# EasyEDA Pro project ALU.eprj

# Schematic Schematic2
Board Name: Board2; Create Date: 2025-08-15; Page Name: P1; Project Name: ALU; Schematic Name: Schematic2; Update Date: 2025-08-15; Company: EasyEDA.com; Page Size: A4; Version: V1.0
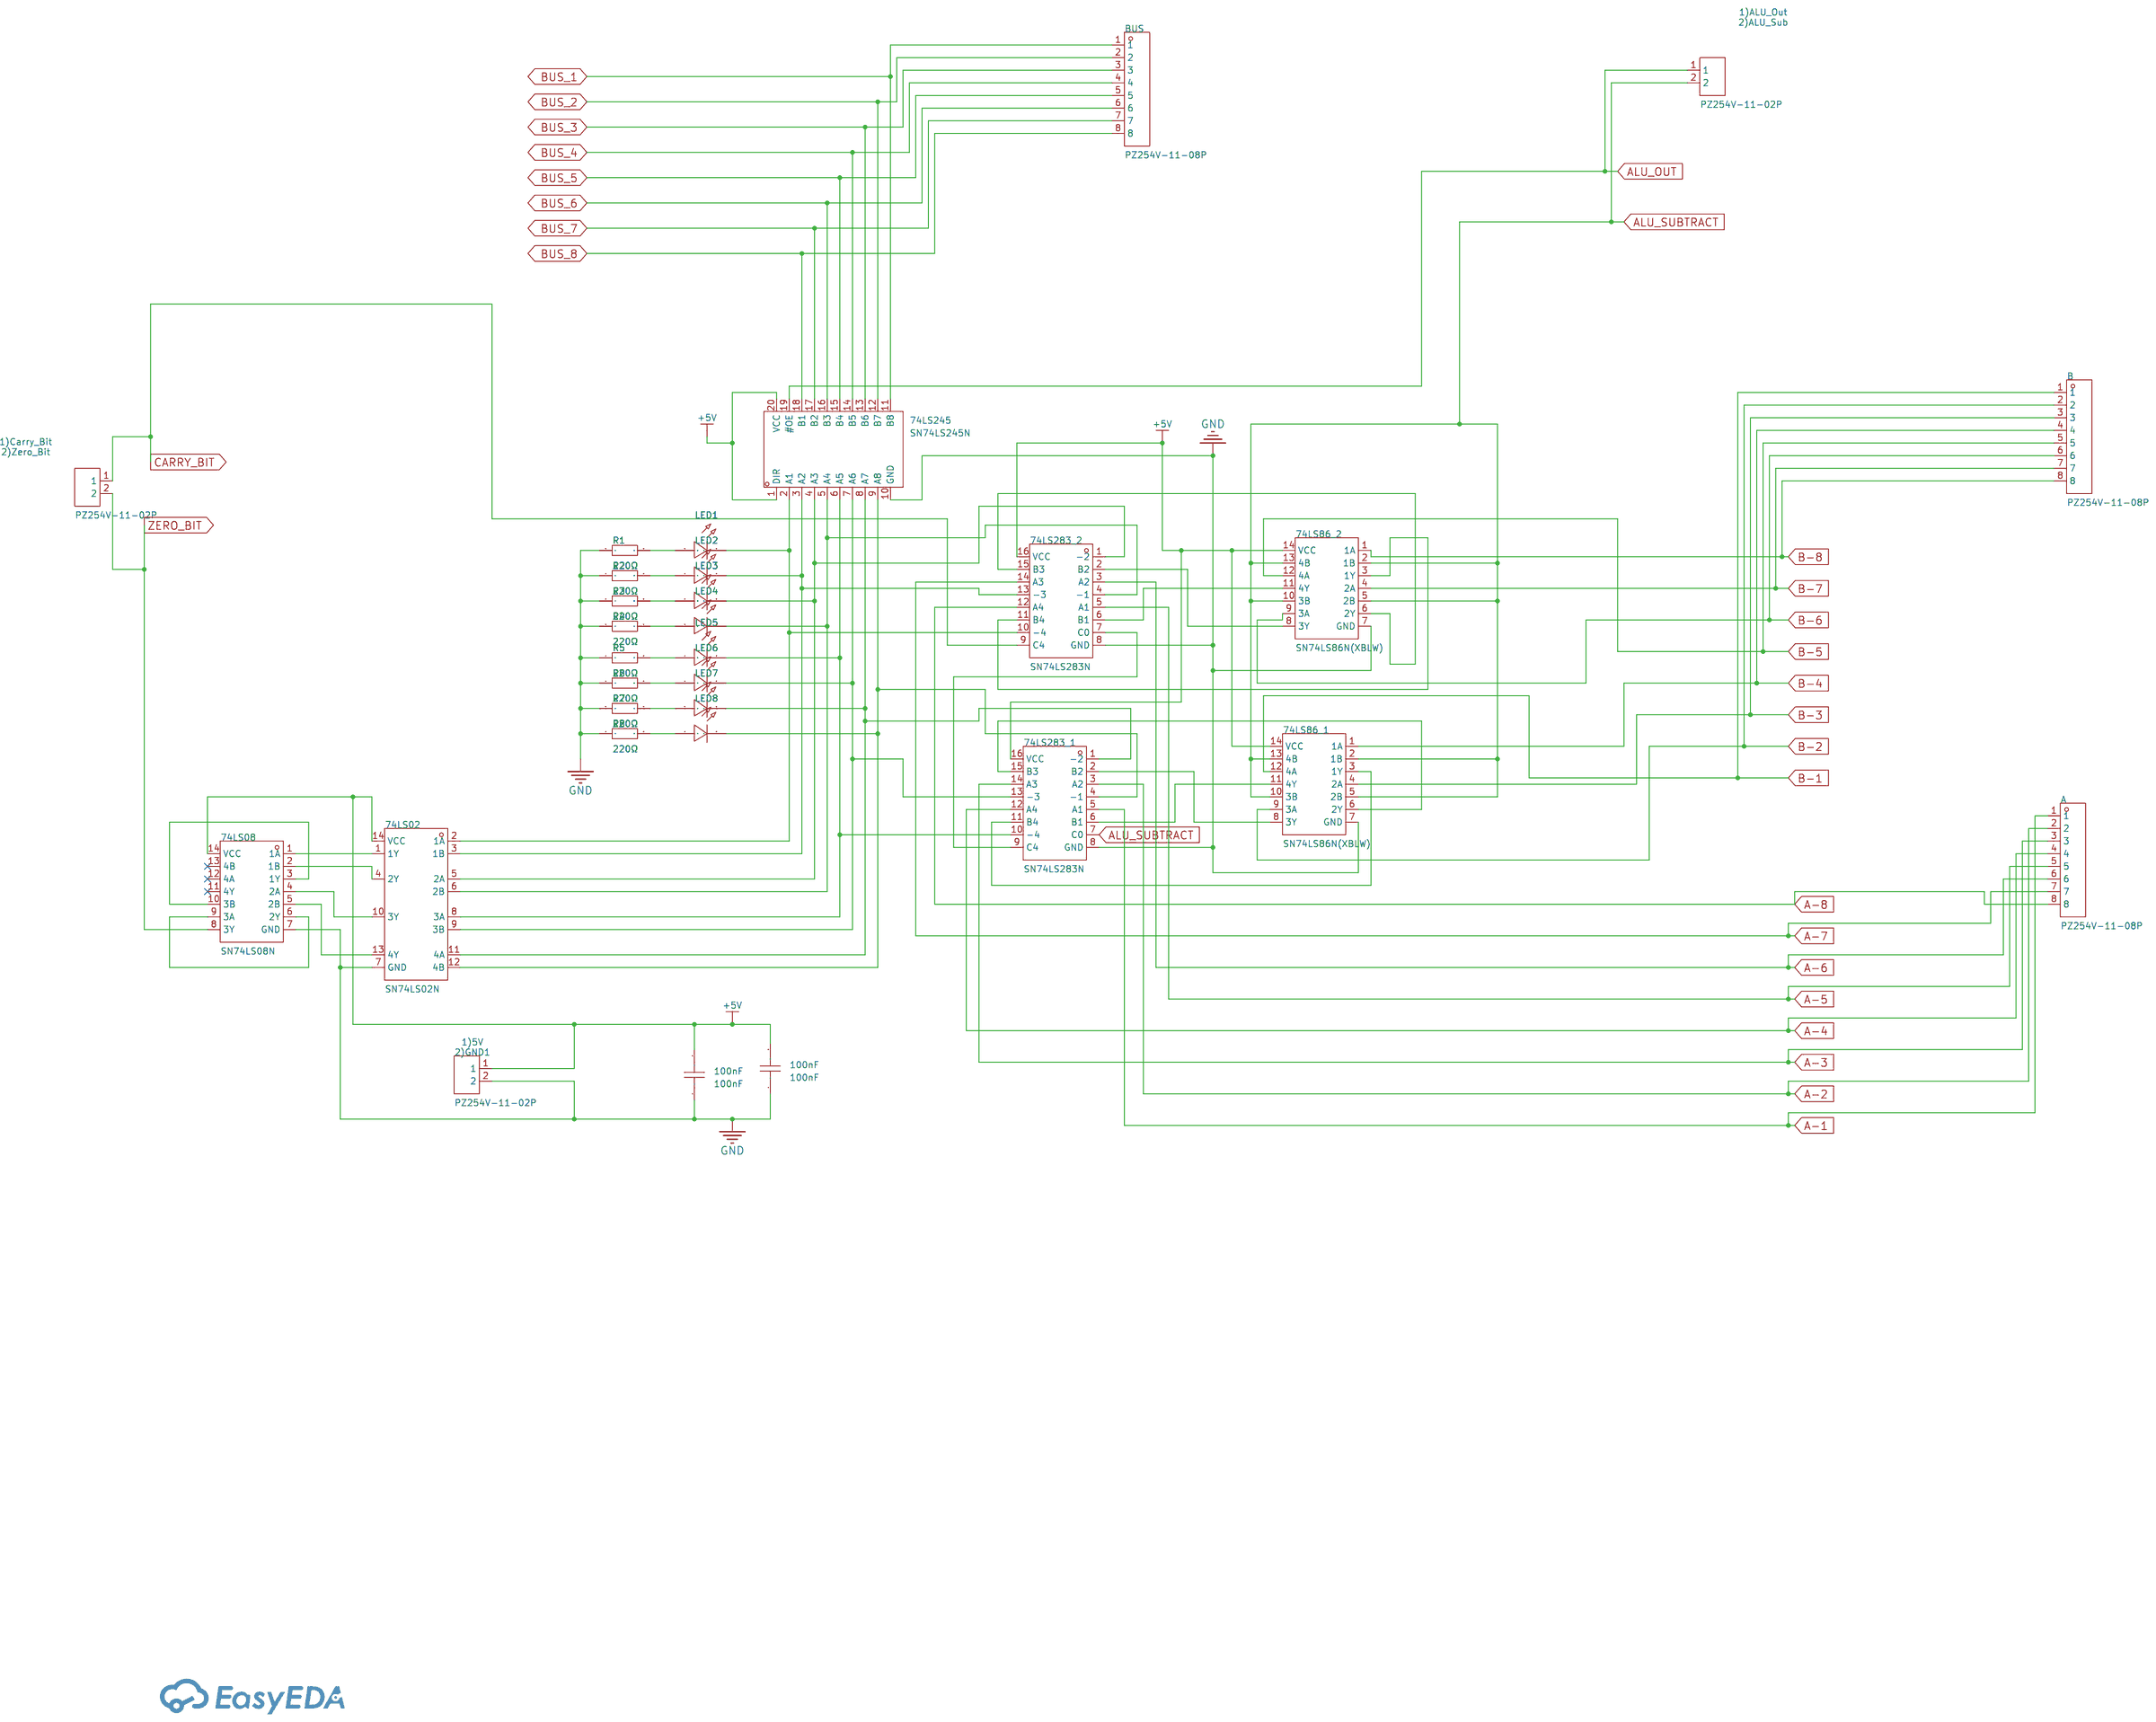
[diagram p0: schematic sheet]

## Parts
1)5V
2)GND1  PZ254V-11-02P  [HDR-TH_2P-P2.54-V-M]
1)ALU_Out
2)ALU_Sub  PZ254V-11-02P  [HDR-TH_2P-P2.54-V-M]
1)Carry_Bit
2)Zero_Bit  PZ254V-11-02P  [HDR-TH_2P-P2.54-V-M]
74LS02  SN74LS02N  [PDIP-14_L19.3-W6.4-P2.54-LS7.6-BL]
74LS08  SN74LS08N  [PDIP-14_L19.3-W6.4-P2.54-LS7.9-BL-1]
74LS86_1  SN74LS86N(XBLW)  [DIP-14_L19.0-W6.4-P2.54-LS7.6-BL]
74LS86_2  SN74LS86N(XBLW)  [DIP-14_L19.0-W6.4-P2.54-LS7.6-BL]
74LS245  SN74LS245N  [DIP-20_L25.5-W10.0-P2.54-LS7.6-BL]
74LS283_1  SN74LS283N  [PDIP-16_L19.3-W6.4-P2.54-LS7.94-BL]
74LS283_2  SN74LS283N  [PDIP-16_L19.3-W6.4-P2.54-LS7.94-BL]
100nF  100nF  [CAP-TH_L8.5-W5.0-P5.00-D1.2]
100nF#2  100nF  [CAP-TH_L8.5-W5.0-P5.00-D1.2]
A  PZ254V-11-08P  [HDR-TH_8P-P2.54-V-M]
B  PZ254V-11-08P  [HDR-TH_8P-P2.54-V-M]
BUS  PZ254V-11-08P  [HDR-TH_8P-P2.54-V-M]
LED1  -  [LED-TH_BD5.8-P2.54-FD]
LED2  -  [LED-TH_BD5.8-P2.54-FD]
LED3  -  [LED-TH_BD5.8-P2.54-FD]
LED4  -  [LED-TH_BD5.8-P2.54-FD]
LED5  -  [LED-TH_BD5.8-P2.54-FD]
LED6  -  [LED-TH_BD5.8-P2.54-FD]
LED7  -  [LED-TH_BD5.8-P2.54-FD]
LED8  -  [LED-TH_BD5.8-P2.54-FD]
R1  220Ω  [R_AXIAL-0.4]
R2  220Ω  [R_AXIAL-0.4]
R3  220Ω  [R_AXIAL-0.4]
R4  220Ω  [R_AXIAL-0.4]
R5  220Ω  [R_AXIAL-0.4]
R6  220Ω  [R_AXIAL-0.4]
R7  220Ω  [R_AXIAL-0.4]
R8  220Ω  [R_AXIAL-0.4]

## Library data of the parts
1)5V
2)GND1 1)ALU_Out
2)ALU_Sub 1)Carry_Bit
2)Zero_Bit = PZ254V-11-02P: Pin Structure:1x2P Pitch:2.54mm Row Spacing:- Circluar Pins/Square Pins:Policy Mounting Type:Straight Number of Rows:Single Row Number of Pins:2P Current Rating:- Voltage Rating (Max):- Length of Mating Pin:6mm Insulation Height:2.5mm Length of End Connec; LCSC Part Name: 1x2P 间距:2.54mm 方针 直插; Supplier Part: C492401; Manufacturer: XFCN(兴飞); Supplier Footprint: 插件,P=2.54mm; JLCPCB Part Class: Extended Part; Datasheet: https://atta.szlcsc.com/upload/public/pdf/source/20200309/C492401_A812433581A9B211A7FFA413ADDFF0E5.pdf; Supplier: LCSC; Pin Structure: 1x2P; Pitch: 2.54mm; Circluar Pins/Square Pins: Policy; Mounting Type: Straight; Number of Rows: Single Row; Number of Pins: 2P; Length of Mating Pin: 6mm; Insulation Height: 2.5mm; Length of End Connection Pin: 3mm; Contact Material: Brass; Operating Temperature: -40℃~+105℃; Color: Black
74LS02 = SN74LS02N: Logic Gate Type:NORGate Number of Channels:4 Supply Voltage:4.75V~5.25V Supply Voltage:4.75V~5.25V Sink Current:16mA Source Current:400uA High Level Range (VIH):2V High Level Range (VIH):2V Low Level Range (VIL):800mV Low Level Range (VIL):800mV Series:74; Supplier Part: C273654; Manufacturer: TI(德州仪器); Supplier Footprint: PDIP-14; JLCPCB Part Class: Extended Part; Datasheet: https://www.ti.com/cn/lit/gpn/sn74ls02; Supplier: LCSC; Logic Gate Type: NORGate; Number of Channels: 4; Supply Voltage: 4.75V~5.25V; Sink Current: 16mA; Source Current: 400uA; High Level Range (VIH): 2V; Low Level Range (VIL): 800mV; Series: 74LSSeries; Propagation Delay Time: 15ns@5V,15pF; Operating Temperature: 0℃~+70℃
74LS08 = SN74LS08N: Logic Type:AND Gate Number of Channels:4 Voltage - Supply:4.75V~5.25V Voltage - Supply:4.75V~5.25V Current - Output Low(IOL):8mA Current - Output High(IOH):400uA Input Logic Level - High:2V Input Logic Level - High:2V Input Logic Level - Low:800mV Input L; Supplier Part: C2869595; Manufacturer: TI(德州仪器); Supplier Footprint: PDIP-14; JLCPCB Part Class: Extended Part; Datasheet: https://www.ti.com/cn/lit/gpn/sn54s08; Supplier: LCSC; Logic Type: AND Gate; Number of Channels: 4; Voltage - Supply: 4.75V~5.25V; Current - Output Low(IOL): 8mA; Current - Output High(IOH): 400uA; Input Logic Level - High: 2V; Input Logic Level - Low: 800mV; Series: 74LSSeries; Operating Temperature: 0℃~+70℃
74LS86_1 74LS86_2 = SN74LS86N(XBLW): Logic Type:XOR Gate Number of Channels:4 Voltage - Supply:2V~6V Voltage - Supply:2V~6V Quiescent Current:2uA Current - Output Low(IOL):5.2mA Current - Output High(IOH):5.2mA Input Logic Level - High:1.2V~3.2V Input Logic Level - High:1.2V~3.2V Input Logic; Supplier Part: C42415784; Manufacturer: XBLW(芯伯乐); Supplier Footprint: DIP-14; Datasheet: https://atta.szlcsc.com/upload/public/pdf/source/20241217/4BD867E8FF5FB27D45A6321784BC3EB1.pdf; Supplier: LCSC; Logic Type: XOR Gate; Number of Channels: 4; Voltage - Supply: 2V~6V; Quiescent Current: 2uA; Current - Output Low(IOL): 5.2mA; Current - Output High(IOH): 5.2mA; Input Logic Level - High: 1.2V~3.2V; Input Logic Level - Low: 800mV~2.8V; Output Logic Level - High: 2V~5.81V
74LS245 = SN74LS245N: output type:Tri-State Voltage - Supply:4.75V~5.25V Voltage - Supply:4.75V~5.25V Number of Elements:1 Number of Bits per Element:8 Current - Output Low(IOL):24mA Current - Output High(IOH):15mA Logic Family:74LS Operating Temperature:0℃~+70℃ Operating Temp; Supplier Part: C352966; Manufacturer: TI(德州仪器); Supplier Footprint: DIP-20; JLCPCB Part Class: Extended Part; Datasheet: https://www.ti.com/cn/lit/gpn/sn74ls245; Supplier: LCSC; output type: Tri-State; Voltage - Supply: 4.75V~5.25V; Number of Elements: 1; Number of Bits per Element: 8; Current - Output Low(IOL): 24mA; Current - Output High(IOH): 15mA; Logic Family: 74LS; Operating Temperature: 0℃~+70℃
74LS283_1 74LS283_2 = SN74LS283N: LCSC Part Name: 二进制全加器; Supplier Part: C1523494; Manufacturer: TI(德州仪器); Supplier Footprint: PDIP-16; JLCPCB Part Class: Extended Part; Datasheet: https://www.ti.com/cn/lit/gpn/sn74ls283; Supplier: LCSC
100nF 100nF#2 = CT4-0805B104K500F3: Capacitance:100nF Tolerance:±10% Tolerance:±10% Voltage Rated: Temperature Coefficient:; LCSC Part Name: 100nF ±10% 50V C3型（直脚）; Supplier Part: C84772; Manufacturer: FH(风华); Supplier Footprint: 插件,P=5.08mm; JLCPCB Part Class: Extended Part; Datasheet: https://atta.szlcsc.com/upload/public/pdf/source/20190402/C385200_059806A6312B28FF1421A2413EB641E1.pdf; Supplier: LCSC; Tolerance: ±10%
A B BUS = PZ254V-11-08P: Pin Structure:1x8P Pitch:2.54mm Row Spacing:- Circluar Pins/Square Pins:Square Pins Mounting Type:Straight Number of Rows:Plugin Number of Pins:8P Current Rating (Max):- Voltage Rating (Max):- Length of Mating Pin:6mm Insulation Height:2.5mm Length of End; LCSC Part Name: 间距:2.54mm 1x8P 直插 方针; Supplier Part: C492407; Manufacturer: XFCN(兴飞); Supplier Footprint: 插件,P=2.54mm; JLCPCB Part Class: Extended Part; Datasheet: https://atta.szlcsc.com/upload/public/pdf/source/20200309/C492407_83A6FB26A2233368EDB9516968EC6149.pdf; Supplier: LCSC; Pin Structure: 1x8P; Pitch: 2.54mm; Circluar Pins/Square Pins: Square Pins; Mounting Type: Straight; Number of Rows: Plugin; Number of Pins: 8P; Length of Mating Pin: 6mm; Insulation Height: 2.5mm; Length of End Connection Pin: 3mm; Operating Temperature Range: -40℃~+105℃; Color: Black
LED1-LED8 = LED_TH-R_5mm: Supplier Footprint: Through
R1-R8 = Res_AXIAL-1/4W: Supplier Footprint: Through

## Nets
+5V: 1)5V
2)GND1.1 74LS02.14(VCC) 74LS08.14(VCC) 74LS86_1.14(VCC) 74LS86_2.14(VCC) 74LS245.1(DIR) 74LS245.20(VCC) 74LS283_1.16(VCC) 74LS283_2.16(VCC) 100nF.2 100nF#2.2
GND: 1)5V
2)GND1.2 74LS02.7(GND) 74LS08.7(GND) 74LS86_1.7(GND) 74LS86_2.7(GND) 74LS245.10(GND) 74LS283_1.8(GND) 74LS283_2.8(GND) 100nF.1 100nF#2.1 R1.1 R2.1 R3.1 R4.1 R5.1 R6.1 R7.1 R8.1
A-1: 74LS283_1.5(A1) A.1
A-2: 74LS283_1.3(A2) A.2
A-3: 74LS283_1.14(A3) A.3
A-4: 74LS283_1.12(A4) A.4
A-5: 74LS283_2.5(A1) A.5
A-6: 74LS283_2.3(A2) A.6
A-7: 74LS283_2.14(A3) A.7
A-8: 74LS283_2.12(A4) A.8
ALU_OUT: 1)ALU_Out
2)ALU_Sub.1 74LS245.19(#OE)
ALU_SUBTRACT: 1)ALU_Out
2)ALU_Sub.2 74LS86_1.2(1B) 74LS86_1.5(2B) 74LS86_1.10(3B) 74LS86_1.13(4B) 74LS86_2.2(1B) 74LS86_2.5(2B) 74LS86_2.10(3B) 74LS86_2.13(4B) 74LS283_1.7(C0)
B-1: 74LS86_1.12(4A) B.1
B-2: 74LS86_1.9(3A) B.2
B-3: 74LS86_1.4(2A) B.3
B-4: 74LS86_1.1(1A) B.4
B-5: 74LS86_2.12(4A) B.5
B-6: 74LS86_2.9(3A) B.6
B-7: 74LS86_2.4(2A) B.7
B-8: 74LS86_2.1(1A) B.8
BUS_1: 74LS245.11(B8) BUS.1
BUS_2: 74LS245.12(B7) BUS.2
BUS_3: 74LS245.13(B6) BUS.3
BUS_4: 74LS245.14(B5) BUS.4
BUS_5: 74LS245.15(B4) BUS.5
BUS_6: 74LS245.16(B3) BUS.6
BUS_7: 74LS245.17(B2) BUS.7
BUS_8: 74LS245.18(B1) BUS.8
CARRY_BIT: 1)Carry_Bit
2)Zero_Bit.1 74LS283_2.9(C4)
ZERO_BIT: 1)Carry_Bit
2)Zero_Bit.2 74LS08.8(3Y)
$1N3474: LED1.1(C) R1.2
$1N3475: 74LS02.2(1A) 74LS245.2(A1) 74LS283_2.10(-4) LED1.2(A)
$1N3476: LED2.1(C) R2.2
$1N3477: LED3.1(C) R3.2
$1N3478: 74LS02.5(2A) 74LS245.4(A3) 74LS283_2.1(-2) LED3.2(A)
$1N3479: LED4.1(C) R4.2
$1N3480: LED5.1(C) R5.2
$1N3481: LED6.1(C) R6.2
$1N3482: LED7.1(C) R7.2
$1N3483: 74LS02.11(4A) 74LS245.8(A7) 74LS283_1.1(-2) LED7.2(A)
$1N3484: LED8.1(C) R8.2
$1N3486: 74LS02.1(1Y) 74LS08.1(1A)
$1N3487: 74LS08.3(1Y) 74LS08.10(3B)
$1N3488: 74LS02.10(3Y) 74LS08.4(2A)
$1N3489: 74LS02.4(2Y) 74LS08.2(1B)
$1N3491: 74LS02.8(3A) 74LS245.6(A5) 74LS283_1.10(-4) LED5.2(A)
$1N3492: 74LS02.6(2B) 74LS245.5(A4) 74LS283_2.4(-1) LED4.2(A)
$1N3493: 74LS02.3(1B) 74LS245.3(A2) 74LS283_2.13(-3) LED2.2(A)
$1N3494: 74LS283_1.9(C4) 74LS283_2.7(C0)
$1N3495: 74LS02.12(4B) 74LS245.9(A8) 74LS283_1.4(-1) LED8.2(A)
$1N3496: 74LS02.9(3B) 74LS245.7(A6) 74LS283_1.13(-3) LED6.2(A)
$1N3497: 74LS86_2.3(1Y) 74LS283_2.11(B4)
$1N3498: 74LS86_2.8(3Y) 74LS283_2.2(B2)
$1N3499: 74LS86_2.11(4Y) 74LS283_2.6(B1)
$1N3502: 74LS86_1.3(1Y) 74LS283_1.11(B4)
$1N3503: 74LS86_1.6(2Y) 74LS283_1.15(B3)
$1N3504: 74LS86_1.11(4Y) 74LS283_1.6(B1)
$1N3511: 74LS86_1.8(3Y) 74LS283_1.2(B2)
$1N3518: 74LS86_2.6(2Y) 74LS283_2.15(B3)
$1N3523: 74LS08.6(2Y) 74LS08.9(3A)
$1N3524: 74LS02.13(4Y) 74LS08.5(2B)

Not connected (* = marked no-connect by the designer): 74LS08 11(4Y)* 12(4A)* 13(4B)*

# Board PCB2
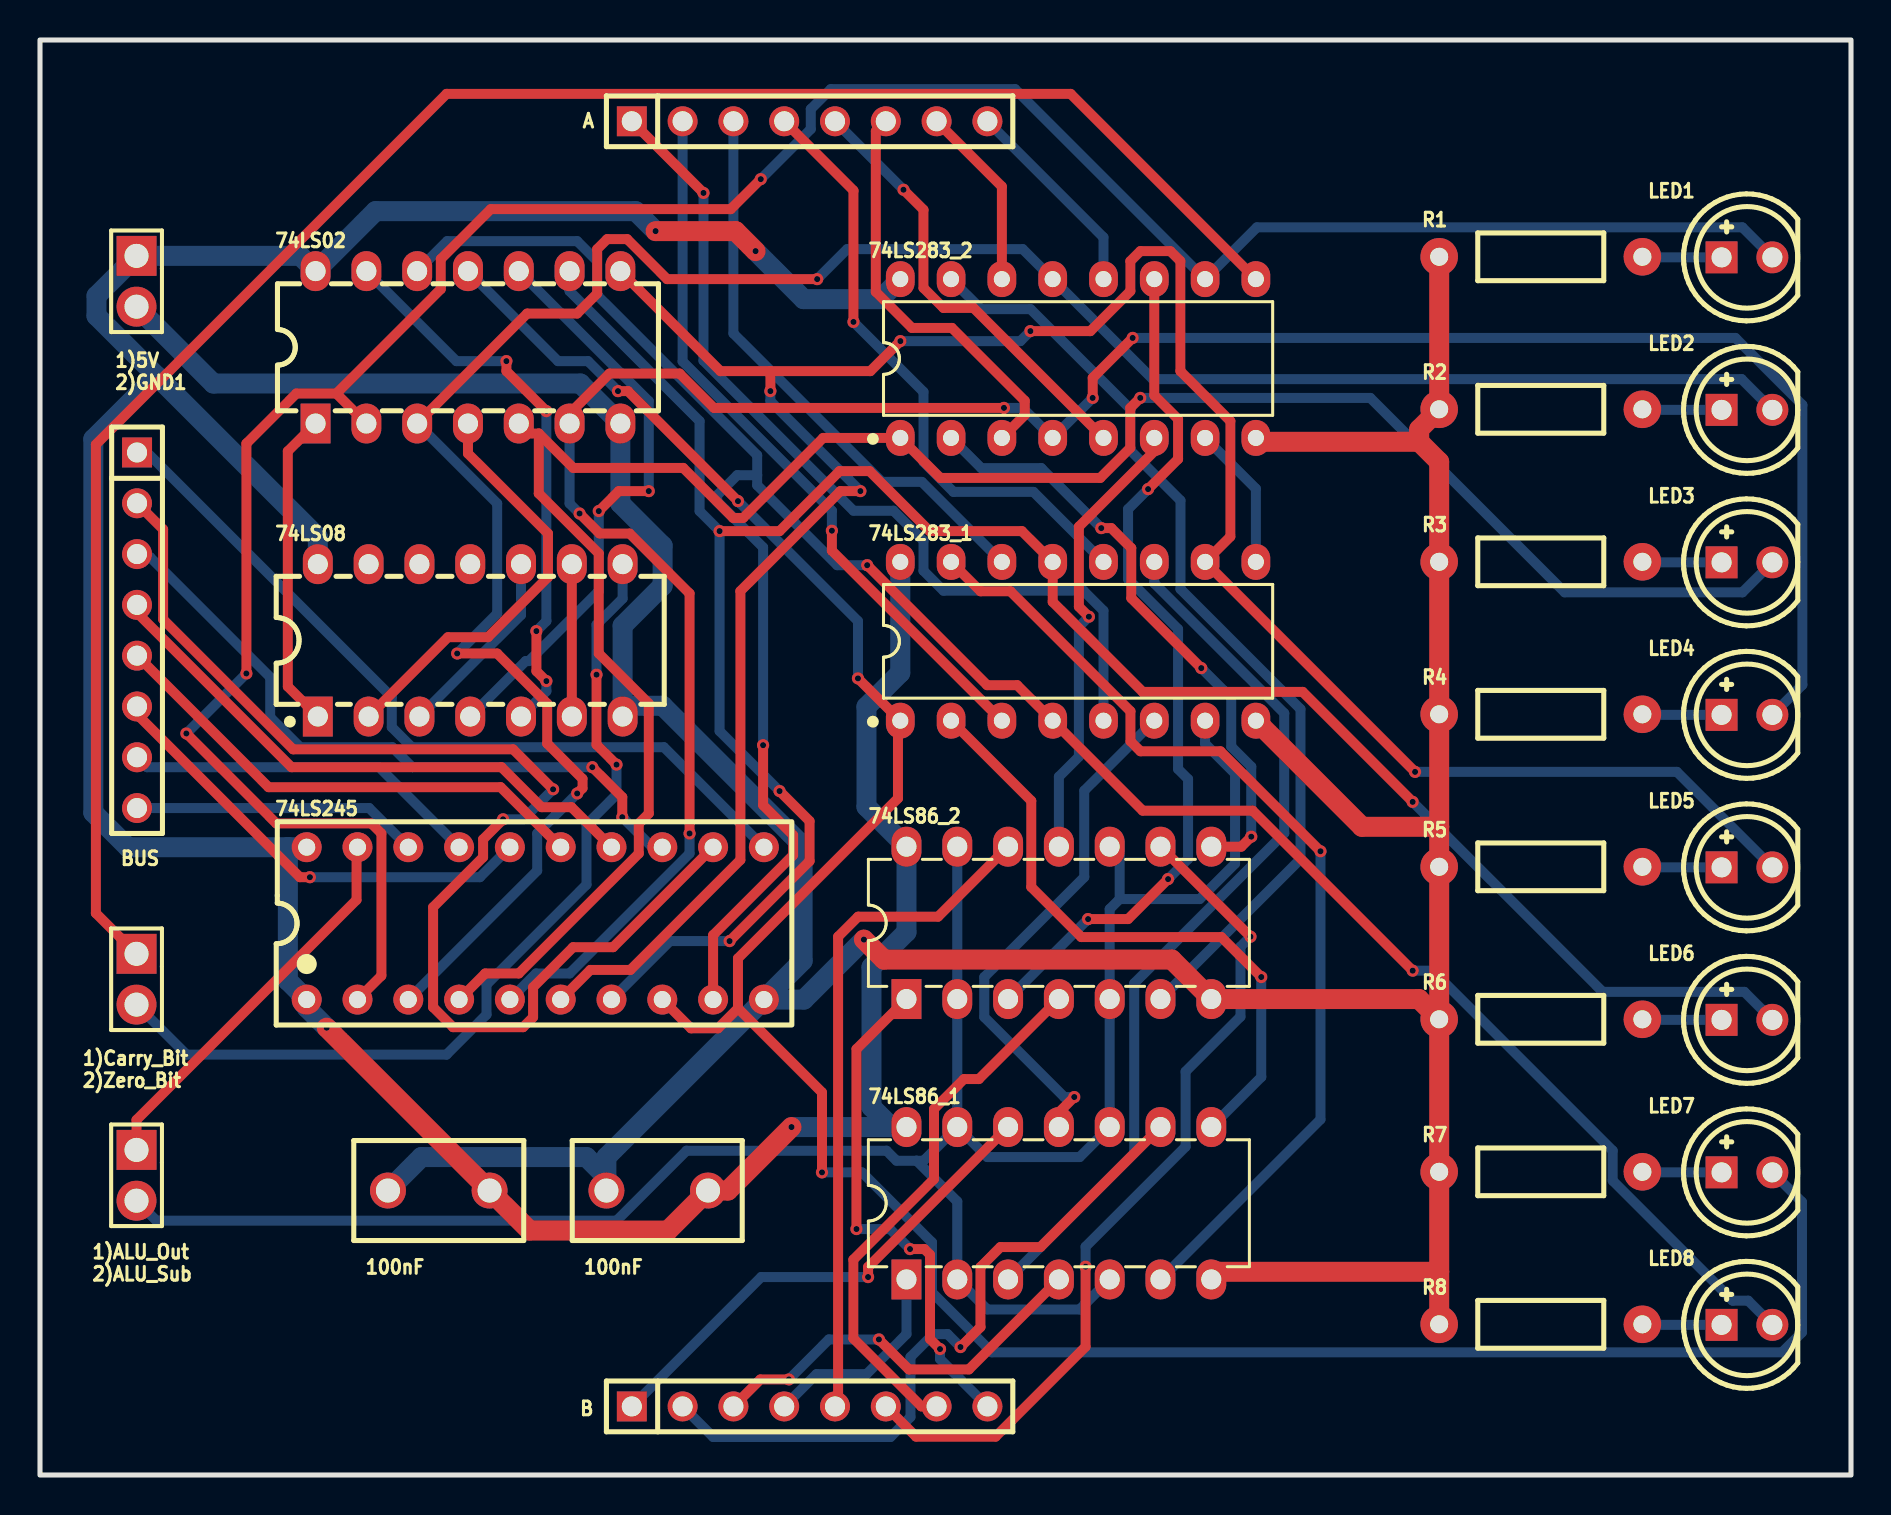
[diagram p1: board, top side]
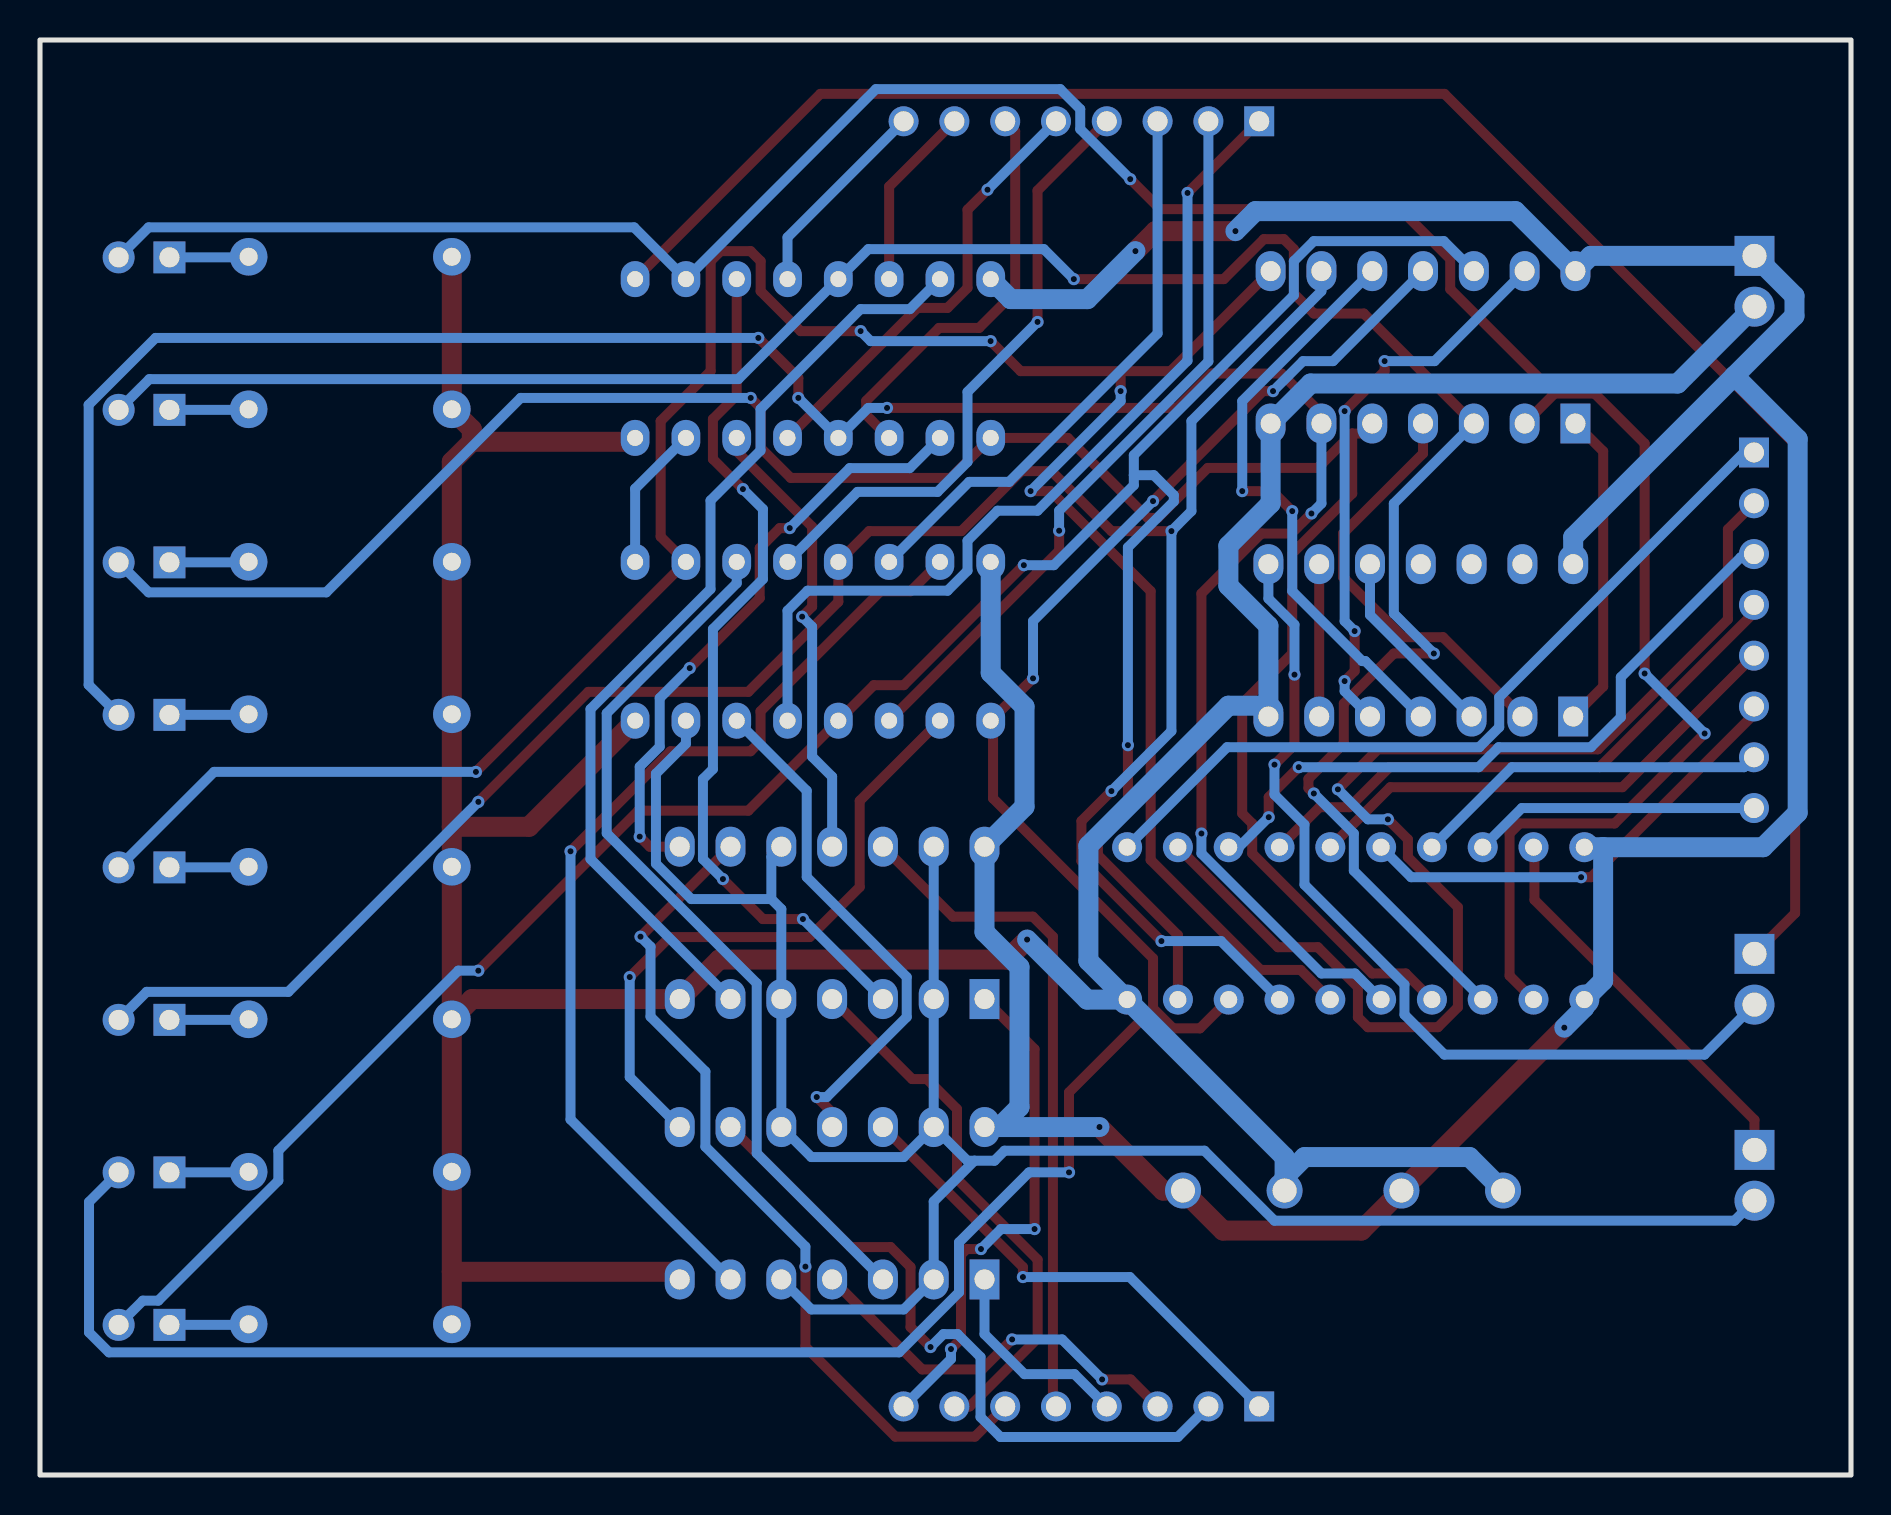
[diagram p2: board, bottom side, seen from below]

Outline 90.55 x 71.75 mm; copper layers: Top Layer, Bottom Layer. Coordinates in mm from the lower left corner of the outline.
Outline path: rectangle 0,71.75 90.55,0
Stack: Top Layer 0.035mm / Dielectric1 1.51mm FR4 er 4.5 / Bottom Layer 0.035mm

## Design rules (mm)
template: Custom Config
spacing copperThickness1oz (default): track to track 0.102, other pairs 0.152 to 0.3
spacing copperThickness2oz: track to track 0.203, other pairs 0.152 to 0.3
track width copperThickness1oz (default): min 0.127, default 0.5, max 2.54
track width copperThickness2oz: min 0.203, default 1, max 2.54
differential pair differentialPair (default): width min 0.127, default 0.254, max 2.54; gap min 0.152, default 0.152
via viaSize (default): diameter min 0.5, default 0.61, max 10; hole min 0.3, default 0.305, max 6.3
net +5V uses copperThickness2oz
net GND uses copperThickness2oz

## Placement (name value [footprint] x y rotation side)
1)5V
2)GND1  PZ254V-11-02P  [HDR-TH_2P-P2.54-V-M]  4.83 59.69 270 top
1)ALU_Out
2)ALU_Sub  PZ254V-11-02P  [HDR-TH_2P-P2.54-V-M]  4.83 14.99 270 top
1)Carry_Bit
2)Zero_Bit  PZ254V-11-02P  [HDR-TH_2P-P2.54-V-M]  4.83 24.79 270 top
74LS02  SN74LS02N  [PDIP-14_L19.3-W6.4-P2.54-LS7.6-BL]  21.4 56.39 0 top
74LS08  SN74LS08N  [PDIP-14_L19.3-W6.4-P2.54-LS7.9-BL-1]  21.51 41.74 0 top
74LS86_1  SN74LS86N(XBLW)  [DIP-14_L19.0-W6.4-P2.54-LS7.6-BL]  50.94 13.59 0 top
74LS86_2  SN74LS86N(XBLW)  [DIP-14_L19.0-W6.4-P2.54-LS7.6-BL]  50.94 27.61 0 top
74LS245  SN74LS245N  [DIP-20_L25.5-W10.0-P2.54-LS7.6-BL]  24.77 27.58 0 top
74LS283_1  SN74LS283N  [PDIP-16_L19.3-W6.4-P2.54-LS7.94-BL]  51.9 41.69 0 top
74LS283_2  SN74LS283N  [PDIP-16_L19.3-W6.4-P2.54-LS7.94-BL]  51.9 55.83 0 top
100nF  100nF  [CAP-TH_L8.5-W5.0-P5.00-D1.2]  19.94 14.22 0 top
100nF#2  100nF  [CAP-TH_L8.5-W5.0-P5.00-D1.2]  30.86 14.22 0 top
A  PZ254V-11-08P  [HDR-TH_8P-P2.54-V-M]  38.48 67.69 0 top
B  PZ254V-11-08P  [HDR-TH_8P-P2.54-V-M]  38.48 3.43 0 top
BUS  PZ254V-11-08P  [HDR-TH_8P-P2.54-V-M]  4.85 42.24 270 top
LED1  -  [LED-TH_BD5.8-P2.54-FD]  85.35 60.89 0 top
LED2  -  [LED-TH_BD5.8-P2.54-FD]  85.35 53.26 0 top
LED3  -  [LED-TH_BD5.8-P2.54-FD]  85.35 45.63 0 top
LED4  -  [LED-TH_BD5.8-P2.54-FD]  85.35 38.01 0 top
LED5  -  [LED-TH_BD5.8-P2.54-FD]  85.35 30.38 0 top
LED6  -  [LED-TH_BD5.8-P2.54-FD]  85.35 22.76 0 top
LED7  -  [LED-TH_BD5.8-P2.54-FD]  85.35 15.13 0 top
LED8  -  [LED-TH_BD5.8-P2.54-FD]  85.35 7.51 0 top
R1  220Ω  [R_AXIAL-0.4]  75.04 60.91 0 top
R2  220Ω  [R_AXIAL-0.4]  75.04 53.29 0 top
R3  220Ω  [R_AXIAL-0.4]  75.04 45.66 0 top
R4  220Ω  [R_AXIAL-0.4]  75.04 38.04 0 top
R5  220Ω  [R_AXIAL-0.4]  75.04 30.41 0 top
R6  220Ω  [R_AXIAL-0.4]  75.04 22.79 0 top
R7  220Ω  [R_AXIAL-0.4]  75.04 15.16 0 top
R8  220Ω  [R_AXIAL-0.4]  75.04 7.54 0 top

## Footprints (pads in the part's own frame, mm; a bottom-side part is the same pattern mirrored in y, then rotated)
CAP-TH_L8.5-W5.0-P5.00-D1.2
  round 1.8 hole 1.2: 1(-2.54,0) 2(2.54,0)
DIP-14_L19.0-W6.4-P2.54-LS7.6-BL
  rect 1.5x2 hole 1: 1(-7.62,-3.81)
  oval 1.5x2 hole 1: 2(-5.08,-3.81) 3(-2.54,-3.81) 4(0,-3.81) 5(2.54,-3.81) 6(5.08,-3.81) 7(7.62,-3.81) 8(7.62,3.81) 9(5.08,3.81) 10(2.54,3.81) 11(0,3.81) 12(-2.54,3.81) 13(-5.08,3.81) 14(-7.62,3.81)
DIP-20_L25.5-W10.0-P2.54-LS7.6-BL
  round 1.5 hole 0.85: 1(-11.43,-3.81) 2(-8.89,-3.81) 3(-6.35,-3.81) 4(-3.81,-3.81) 5(-1.27,-3.81) 6(1.27,-3.81) 7(3.81,-3.81) 8(6.35,-3.81) 9(8.89,-3.81) 10(11.43,-3.81) 11(11.43,3.81) 12(8.89,3.81) 13(6.35,3.81) 14(3.81,3.81) 15(1.27,3.81) 16(-1.27,3.81) 17(-3.81,3.81) 18(-6.35,3.81) 19(-8.89,3.81) 20(-11.43,3.81)
HDR-TH_2P-P2.54-V-M
  rect 2x2 hole 1.2: 1(-1.27,0)
  round 2 hole 1.2: 2(1.27,0)
HDR-TH_8P-P2.54-V-M
  rect 1.5x1.5 hole 1: 1(-8.89,0)
  round 1.5 hole 1: 2(-6.35,0) 3(-3.81,0) 4(-1.27,0) 5(1.27,0) 6(3.81,0) 7(6.35,0) 8(8.89,0)
LED-TH_BD5.8-P2.54-FD
  rect 1.6x1.6 hole 1: 1(-1.27,0)
  round 1.6 hole 1: 2(1.27,0)
PDIP-14_L19.3-W6.4-P2.54-LS7.6-BL
  rect 1.5x2 hole 1: 1(-7.62,-3.81)
  oval 1.5x2 hole 1: 2(-5.08,-3.81) 3(-2.54,-3.81) 4(0,-3.81) 5(2.54,-3.81) 6(5.08,-3.81) 7(7.62,-3.81) 8(7.62,3.81) 9(5.08,3.81) 10(2.54,3.81) 11(0,3.81) 12(-2.54,3.81) 13(-5.08,3.81) 14(-7.62,3.81)
PDIP-14_L19.3-W6.4-P2.54-LS7.9-BL-1
  rect 1.5x2 hole 1: 1(-7.62,-3.809)
  oval 1.5x2 hole 1: 2(-5.08,-3.81) 3(-2.54,-3.81) 4(0,-3.81) 5(2.54,-3.81) 6(5.08,-3.81) 7(7.62,-3.81) 8(7.62,3.81) 9(5.08,3.81) 10(2.54,3.81) 11(0,3.81) 12(-2.54,3.81) 13(-5.08,3.81) 14(-7.62,3.81)
PDIP-16_L19.3-W6.4-P2.54-LS7.94-BL
  oval 1.44x1.8 hole 0.8: 1(-8.89,-3.97) 2(-6.35,-3.97) 3(-3.81,-3.97) 4(-1.27,-3.97) 5(1.27,-3.97) 6(3.81,-3.97) 7(6.35,-3.97) 8(8.89,-3.97) 9(8.89,3.97) 10(6.35,3.97) 11(3.81,3.97) 12(1.27,3.97) 13(-1.27,3.97) 14(-3.81,3.97) 15(-6.35,3.97) 16(-8.89,3.97)
R_AXIAL-0.4
  round 1.879 hole 0.899: 1(-5.08,0) 2(5.08,0)

## Nets
As in the schematic.

Pads without a net: 74LS08 11 12 13

## Via types
v1: diameter 0.61, hole 0.305, Top Layer to Bottom Layer, 69 vias

## Routing (per net, layer and track width the routed paths; a pad name or vN(x,y) marks a point on that pad's centre or on a via; arc(x,y) is an arc through that point)
+5V: length 173.4
  Top Layer w1: v1(35.78,61.2) 34.78,62.2 v1(30.78,62.2) ; v1(37.58,17.4) 34.4,14.22 100nF#2.2 31.4,12.22 24.48,12.22 100nF.2 v1(14.34,22.37)
  Bottom Layer w1: v1(35.78,61.2) 38.18,58.8 42.01,58.8 74LS283_2.16 ; 12.39,31.39 74LS245.20 ; 12.39,31.39 4.39,31.39 2.67,33.12 2.67,51.8 5.83,54.96 ; 12.39,31.39 12.39,24.71 74LS245.1 13.34,23.37 v1(14.34,22.37) ; 5.83,54.96 2.83,57.96 2.83,58.96 1)5V
2)GND1.1 13.02,60.96 13.78,60.2 16.78,63.2 29.78,63.2 v1(30.78,62.2) ; 5.83,54.96 13.89,46.89 74LS08.14 ; 42.58,17.4 41.58,18.4 41.58,25.4 43.32,27.15 74LS86_2.14 41.32,33.42 41.32,38.42 43.01,40.11 74LS283_1.16 ; 42.58,17.4 v1(37.58,17.4) ; 42.58,17.4 74LS86_1.14
GND: length 210.2
  Top Layer w1: 68.96,51.66 68.96,52.29 R2.1 R1.1 ; 68.96,51.66 69.96,50.66 R3.1 R4.1 69.96,32.41 ; 68.96,51.66 60.99,51.66 74LS283_2.8 ; v1(41.19,26.77) 42.19,25.77 56.59,25.77 74LS86_2.7 68.95,23.8 R6.1 ; 74LS86_1.7 58.95,10.16 69.96,10.16 ; 69.96,32.41 R5.1 R6.1 ; 69.96,32.41 66.1,32.41 74LS283_1.8 ; 69.96,10.16 R8.1 ; 69.96,10.16 R7.1 R6.1
  Bottom Layer w1: v1(41.19,26.77) 38.19,23.77 74LS245.10 ; 74LS245.10 28.32,15.9 28.32,14.9 ; 74LS245.10 38.13,25.71 38.13,31.47 31.13,38.47 29.13,38.47 ; 28.32,14.9 28.32,14.22 ; 28.32,14.9 27.32,15.9 19.07,15.9 100nF.1 ; 1)5V
2)GND1.2 8.67,54.58 27.02,54.58 74LS02.7 29.02,48.58 31.13,46.47 31.13,44.47 29.13,42.47 29.13,38.47 ; 29.13,38.47 74LS08.7
A-1: length 45
  Top Layer w0.5: v1(33.17,64.11) A.1
  Bottom Layer w0.5: 74LS283_1.5 53.17,43.22 52.17,44.22 45.17,44.22 44.17,45.22 44.17,46.72 42.67,48.22 40.67,48.22 33.17,55.72 v1(33.17,64.11)
A-2: length 36.6
  Top Layer w0.5: 74LS283_1.3 39.59,46.22 v1(39.59,47.22)
  Bottom Layer w0.5: v1(39.59,47.22) 39.59,48.22 32.13,55.68 A.2
A-3: length 28.8
  Bottom Layer w0.5: A.3 34.67,57.08 42.09,49.66 44.09,49.66 74LS283_1.14
A-4: length 31
  Top Layer w0.5: 37.21,67.69 40.67,64.23 v1(40.67,57.66)
  Bottom Layer w0.5: 74LS283_1.12 49.67,49.16 45.67,49.16 44.17,50.66 44.17,54.16 v1(40.67,57.66)
A-5: length 22.3
  Top Layer w0.5: 74LS283_2.5 46.67,58.36 45.17,58.36 44.17,59.36 44.17,63.27 v1(43.17,64.27)
  Bottom Layer w0.5: v1(43.17,64.27) A.5
A-6: length 20.8
  Top Layer w0.5: A.6 41.79,67.19 41.79,59.16 43.59,57.36 45.59,57.36 49.24,53.71 49.24,53 74LS283_2.3
A-7: length 9.2
  Top Layer w0.5: 44.83,67.69 48.09,64.43 74LS283_2.14
A-8: length 10.3
  Bottom Layer w0.5: 74LS283_2.12 53.17,61.89 47.37,67.69
ALU_OUT: length 19.7
  Top Layer w0.5: 1)ALU_Out
2)ALU_Sub.1 4.83,17.76 15.83,28.76 15.83,31.34 74LS245.19
ALU_SUBTRACT: length 111
  Bottom Layer w0.5: 74LS283_1.7 58.25,36.57 59.75,35.07 59.75,30.57 57.98,28.8 53.98,28.8 ; 43.83,15.72 44.18,15.72 74LS86_1.13 ; 43.83,15.72 45.86,13.68 74LS86_1.2 47.36,8.28 51.98,8.28 74LS86_1.5 ; 43.83,15.72 42.83,15.72 42.33,16.22 32.33,16.22 28.83,12.72 5.83,12.72 1)ALU_Out
2)ALU_Sub.2 ; 74LS86_1.13 47.36,15.9 51.98,15.9 74LS86_1.10 74LS86_2.5 53.48,28.3 53.98,28.8 ; 74LS86_1.13 74LS86_2.2 74LS86_2.13 ; 74LS86_2.10 53.98,30.92 53.98,28.8
B-1: length 24.9
  Top Layer w0.5: v1(41.4,9.9) 41.4,10.4 74LS86_1.12
  Bottom Layer w0.5: B.1 36.06,9.9 v1(41.4,9.9)
B-2: length 35
  Top Layer w0.5: v1(46.02,6.4) 47.02,7.4 47.02,10.4 48.02,11.4 50.02,11.4 74LS86_1.9
  Bottom Layer w0.5: v1(46.02,6.4) 45.38,7.05 44.67,7.05 43.52,5.9 43.52,2.9 42.52,1.9 33.66,1.9 B.2
B-3: length 20.1
  Top Layer w0.5: v1(37.44,4.78) 36.02,4.78 B.3 ; 74LS86_1.4 46.44,5.28 43.44,5.28 v1(41.94,6.78)
  Bottom Layer w0.5: v1(41.94,6.78) 39.44,6.78 v1(37.44,4.78)
B-4: length 10.3
  Bottom Layer w0.5: 37.21,3.43 38.82,5.04 41.32,5.04 43.32,7.04 74LS86_1.1
B-5: length 33.9
  Top Layer w0.5: 74LS86_2.12 44.9,27.92 40.9,27.92 39.9,26.92 39.9,3.58 B.5
B-6: length 42.8
  Top Layer w0.5: 74LS86_2.9 v1(60.52,26.92) ; v1(52.28,10.42) 52.28,6.42 47.78,1.92 43.8,1.92 B.6
  Bottom Layer w0.5: v1(60.52,26.92) 60.02,26.42 60.02,22.92 57.28,20.17 57.28,16.42 52.28,11.42 v1(52.28,10.42)
B-7: length 27.2
  Top Layer w0.5: 44.83,3.43 44.07,3.43 40.67,6.83 40.67,10.77 44.7,14.8 44.7,18.3 46.2,19.8 46.94,19.8 74LS86_2.4
B-8: length 25.5
  Top Layer w0.5: 74LS86_2.1 40.82,21.3 v1(40.82,12.3) ; v1(43.5,11.3) 44.22,11.3 44.5,11.01 44.5,6.8 v1(45,6.3)
  Bottom Layer w0.5: v1(45,6.3) 45,5.8 47.37,3.43 ; v1(43.5,11.3) 42.5,12.3 v1(40.82,12.3)
BUS_1: length 40.4
  Bottom Layer w0.5: 74LS245.11 31.19,36.39 18.59,36.39 17.59,37.39 17.59,38.89 5.35,51.13 BUS.1
BUS_2: length 62.4
  Top Layer w0.5: v1(25.66,34.29) 23.66,36.29 12.66,36.29 6.16,42.79 6.16,47.29 BUS.2 ; v1(23.16,32.79) 22.16,31.79 22.16,30.89 19.66,28.39 19.66,23.39 20.66,22.39 24.16,22.39 24.66,22.89 24.66,24.39 26.66,26.39 28.66,26.39 74LS245.12
  Bottom Layer w0.5: v1(25.66,34.29) 24.16,32.79 v1(23.16,32.79)
BUS_3: length 34.1
  Top Layer w0.5: v1(29.12,32.89) 29.12,33.89 v1(27.62,35.39)
  Bottom Layer w0.5: v1(29.12,32.89) 30.62,31.39 74LS245.13 ; BUS.3 5.01,45.89 5.51,45.89 11.51,39.89 11.51,37.89 13.01,36.39 17.62,36.39 18.62,35.39 v1(27.62,35.39)
BUS_4: length 29
  Top Layer w0.5: BUS.4 4.85,43.12 12.58,35.39 23.08,35.39 25.08,33.39 26.58,33.39 74LS245.14
BUS_5: length 25.2
  Top Layer w0.5: BUS.5 11.43,34.39 23.03,34.39 74LS245.15
BUS_6: length 23
  Top Layer w0.5: BUS.6 5,38.29 5,37.89 13,29.89 v1(13.5,29.89)
  Bottom Layer w0.5: 74LS245.16 22,29.89 v1(13.5,29.89)
BUS_7: length 18
  Bottom Layer w0.5: BUS.7 5.35,35.39 16.96,35.39 74LS245.17
BUS_8: length 14.4
  Bottom Layer w0.5: 74LS245.18 16.46,33.35 BUS.8
CARRY_BIT: length 95.4
  Top Layer w0.5: 1)Carry_Bit
2)Zero_Bit.1 2.79,28.09 2.79,51.53 20.33,69.06 51.53,69.06 74LS283_2.9
ZERO_BIT: length 45.5
  Top Layer w0.5: v1(28.83,35.52) 27.83,36.52 v1(27.83,40.02)
  Bottom Layer w0.5: v1(28.83,35.52) 28.83,34.02 27.33,32.52 27.33,29.52 22.33,24.52 22.33,23.02 20.33,21.02 7.33,21.02 1)Carry_Bit
2)Zero_Bit.2 ; v1(27.83,40.02) 27.83,42.52 29.13,43.83 74LS08.8
$1N3474: length 4
  Bottom Layer w0.5: LED1.1 80.15,60.89 R1.2
$1N3475: length 129.2
  Top Layer w0.5: v1(10.32,40.08) 10.32,51.58 12.82,54.08 14.82,54.08 ; 14.82,54.08 20.04,59.3 20.04,60.8 22.54,63.3 34.54,63.3 v1(36.04,64.8) ; 14.82,54.08 74LS02.2 ; v1(7.32,37.08) 11.82,32.58 16.57,32.58 17.07,32.08 17.07,24.97 74LS245.2
  Bottom Layer w0.5: v1(36.04,64.8) 38.54,67.3 38.54,68.3 39.54,69.3 48.75,69.3 74LS283_2.10 60.84,62.39 85.12,62.39 LED1.2 ; v1(10.32,40.08) v1(7.32,37.08)
$1N3476: length 4
  Bottom Layer w0.5: R2.2 80.15,53.26 LED2.1
$1N3477: length 4
  Bottom Layer w0.5: R3.2 80.15,45.63 LED3.1
$1N3478: length 110.1
  Top Layer w0.5: 24.94,52.08 26.66,50.36 32.16,50.36 34.66,47.86 35.16,47.86 39.16,51.86 74LS283_2.1 45.01,49.86 53.01,49.86 54.51,51.36 54.51,53.36 v1(55.01,53.86) ; 24.94,52.08 24.94,49.08 27.94,46.08 27.94,41.08 30.44,38.58 30.44,33.08 29.94,32.58 29.94,31.08 23.94,25.08 22.26,25.08 74LS245.4 ; 24.94,52.08 24.44,52.08 74LS02.5
  Bottom Layer w0.5: LED3.2 85.12,44.13 76.24,44.13 66.51,53.86 v1(55.01,53.86)
$1N3479: length 4
  Bottom Layer w0.5: LED4.1 80.15,38.01 R4.2
$1N3480: length 4
  Bottom Layer w0.5: LED5.1 80.15,30.38 R5.2
$1N3481: length 4
  Bottom Layer w0.5: R6.2 80.15,22.76 LED6.1
$1N3482: length 4
  Bottom Layer w0.5: R7.2 80.15,15.13 LED7.1
$1N3483: length 128.4
  Top Layer w0.5: v1(40.9,39.83) 42.9,37.83 ; 42.9,37.83 74LS283_1.1 ; 42.9,37.83 42.9,33.83 34.9,25.83 34.9,23.33 ; 34.9,23.33 39.1,19.13 v1(39.1,15.13) ; 34.9,23.33 33.9,22.33 32.55,22.33 74LS245.8 ; v1(34.9,48.7) 29.4,54.2 v1(28.9,54.2)
  Bottom Layer w0.5: v1(34.9,48.7) 40.9,42.7 v1(40.9,39.83) ; v1(39.1,15.13) 41.1,15.13 44.6,11.63 44.6,9.13 47.6,6.13 87.1,6.13 88.1,7.13 88.1,13.65 LED7.2 ; v1(28.9,54.2) 27.4,55.7 25.9,55.7 74LS02.11
$1N3484: length 4
  Bottom Layer w0.5: R8.2 80.15,7.51 LED8.1
$1N3486: length 15.8
  Top Layer w0.5: 13.78,52.58 12.39,51.19 12.39,39.43 74LS08.1
$1N3487: length 9.7
  Bottom Layer w0.5: 74LS08.10 24.05,43.01 74LS08.3
$1N3488: length 29.6
  Top Layer w0.5: v1(27.94,48.2) 28.94,49.2 v1(30.44,49.2)
  Bottom Layer w0.5: 74LS02.10 30.44,53.7 v1(30.44,49.2) ; 74LS08.4 24.28,40.7 24.44,40.7 27.94,44.2 v1(27.94,48.2)
$1N3489: length 21.2
  Top Layer w0.5: 74LS08.2 20.4,41.89 22.4,41.89 25.4,44.89 25.4,47.08 21.4,51.08 74LS02.4
$1N3491: length 126.2
  Top Layer w0.5: v1(68.75,35.16) 74LS283_1.10 59.52,46.92 59.52,52.7 57.02,55.2 57.02,60.7 56.52,61.2 55.02,61.2 54.52,60.7 54.52,59.2 52.52,57.2 v1(49.52,57.2) ; 36.52,55.2 41.52,55.2 v1(43.02,56.7) ; 36.52,55.2 34.02,55.2 74LS02.8 ; 36.52,55.2 v1(36.52,54.2) ; v1(41.02,49.2) 40.02,49.2 35.02,44.2 35.02,30.76 29.52,25.26 27.52,25.26 74LS245.6
  Bottom Layer w0.5: v1(49.52,57.2) 49.02,56.7 v1(43.02,56.7) ; LED5.2 81.84,35.16 v1(68.75,35.16) ; v1(36.52,54.2) 36.52,53.7 v1(41.02,49.2)
$1N3492: length 121.3
  Top Layer w0.5: v1(52.63,53.86) 52.63,54.86 v1(54.63,56.86) ; v1(48.2,53.36) 33.7,53.36 31.98,55.08 28.48,55.08 26.48,53.08 74LS02.6 ; v1(26.98,48.08) 27.98,47.08 29.48,47.08 32.48,44.08 v1(32.48,32.08)
  Bottom Layer w0.5: LED4.2 88.12,39.51 88.12,53.51 84.77,56.86 v1(54.63,56.86) ; v1(52.63,53.86) 74LS283_2.4 49.13,53.36 v1(48.2,53.36) ; v1(32.48,32.08) 32.48,31.08 26.48,25.08 24.8,25.08 74LS245.5 ; v1(26.98,48.08) 26.48,48.58 74LS02.6
$1N3493: length 116.3
  Top Layer w0.5: v1(26.86,34.08) 27.13,34.35 27.13,34.81 25.36,36.58 25.36,38.58 22.86,41.08 v1(20.86,41.08) ; v1(38.86,59.8) 31.36,59.8 29.36,61.8 28.36,61.8 27.86,61.3 27.86,59.08 26.86,58.08 24.36,58.08 18.86,52.58
  Bottom Layer w0.5: LED2.2 85.08,54.8 55.63,54.8 74LS283_2.13 49.13,61.3 40.36,61.3 v1(38.86,59.8) ; 18.86,52.58 22.86,48.58 22.86,43.08 v1(20.86,41.08) ; 74LS245.3 24.86,30.22 24.86,32.08 v1(26.86,34.08)
$1N3494: length 7.3
  Bottom Layer w0.5: 74LS283_1.9 60.79,49.32 74LS283_2.7
$1N3495: length 124.4
  Top Layer w0.5: v1(41.36,45.49) 47.36,39.49 48.86,39.49 74LS283_1.4 55.13,33.22 60.63,33.22 v1(68.63,25.22) ; v1(36.16,36.49) 36.16,33.49 37.66,31.99 37.66,30.99 33.66,26.99 74LS245.9
  Bottom Layer w0.5: 35.86,49.99 35.86,49.49 39.86,45.49 v1(41.36,45.49) ; 35.86,49.99 35.86,50.99 27.86,58.99 27.86,60.7 26.86,61.7 20.36,61.7 18.86,60.2 ; 35.86,49.99 34.86,49.99 33.86,48.99 33.86,48.68 36.16,46.39 v1(36.16,36.49) ; LED8.2 85.41,8.72 84.63,8.72 78.63,14.72 78.63,16.22 69.63,25.22 v1(68.63,25.22)
$1N3496: length 113.7
  Top Layer w0.5: v1(34.48,26.7) 38.48,30.7 38.48,32.7 v1(36.98,34.2) ; v1(68.63,33.66) 63.13,39.16 55.13,39.16 50.63,43.66 74LS283_1.13 49.09,47.2 44.48,47.2 41.48,50.2 39.98,50.2 36.98,47.2 v1(33.98,47.2)
  Bottom Layer w0.5: LED6.2 85.22,24.16 78.13,24.16 v1(68.63,33.66) ; 74LS02.9 26.48,59.2 32.98,52.7 32.98,48.2 v1(33.98,47.2) 33.98,37.2 v1(36.98,34.2) ; 74LS245.7 31.5,26.7 v1(34.48,26.7)
$1N3497: length 43.7
  Top Layer w0.5: 74LS283_2.11 55.71,53.99 56.9,52.8 56.9,50.8 v1(55.4,49.3) ; v1(52.4,27.8) 54.4,27.8 v1(56.4,29.8)
  Bottom Layer w0.5: v1(56.4,29.8) 57.4,30.8 57.4,34.8 56.9,35.3 56.9,42.3 54.4,44.8 54.4,48.3 v1(55.4,49.3) ; 74LS86_2.3 v1(52.4,27.8)
$1N3498: length 30.4
  Top Layer w0.5: 74LS86_2.8 60.06,31.42 v1(60.56,31.92) ; v1(58.06,40.35) 54.56,43.85 54.56,46.35 53.56,47.35 v1(53.06,47.35)
  Bottom Layer w0.5: v1(60.56,31.92) 60.56,35.42 59.56,36.42 59.56,38.85 v1(58.06,40.35) ; v1(53.06,47.35) 50.06,50.35 47.06,50.35 74LS283_2.2
$1N3499: length 22.8
  Top Layer w0.5: v1(52.44,42.92) 51.94,43.42 51.94,47.42 55.71,51.19 74LS283_2.6
  Bottom Layer w0.5: 74LS86_2.11 50.94,34.92 51.94,35.92 51.94,42.42 v1(52.44,42.92)
$1N3502: length 44.3
  Bottom Layer w0.5: 74LS86_1.3 54.71,16.09 54.71,24.59 62.21,32.09 62.21,38.09 55.71,44.59 74LS283_1.11
$1N3503: length 50.1
  Top Layer w0.5: v1(64.02,31.19) 59.02,36.19 55.02,36.19 54.52,36.69 54.52,38.19 48.52,44.19 47.02,44.19 74LS283_1.15
  Bottom Layer w0.5: v1(64.02,31.19) 64.02,17.78 74LS86_1.6
$1N3504: length 26.3
  Top Layer w0.5: v1(51.71,18.9) 50.94,18.13 74LS86_1.11
  Bottom Layer w0.5: 74LS283_1.6 52.21,34.22 52.21,29.9 47.21,24.9 47.21,22.9 51.21,18.9 v1(51.71,18.9)
$1N3511: length 31.9
  Top Layer w0.5: 74LS283_1.2 49.56,33.71 49.56,29.4 52.06,26.9 59.06,26.9 v1(61.06,24.9)
  Bottom Layer w0.5: v1(61.06,24.9) 61.06,19.9 74LS86_1.8
$1N3518: length 47.6
  Bottom Layer w0.5: 74LS86_2.6 63.02,30.8 63.02,38.3 57.02,44.3 57.02,48.73 54.52,51.23 54.52,53.3 49.52,58.3 47.05,58.3 74LS283_2.15
$1N3523: length 7.6
  Top Layer w0.5: 74LS08.6 74LS08.9
$1N3524: length 28.4
  Top Layer w0.5: v1(24.82,42.2) 24.82,40.2 v1(25.32,39.7) ; v1(25.32,53.2) 23.32,55.2 v1(23.32,55.7)
  Bottom Layer w0.5: v1(23.32,55.7) 20.82,55.7 74LS02.13 ; v1(25.32,39.7) 25.32,39.19 74LS08.5 ; v1(25.32,53.2) 25.32,42.7 v1(24.82,42.2)
